# Altium project Mez.PrjPCB
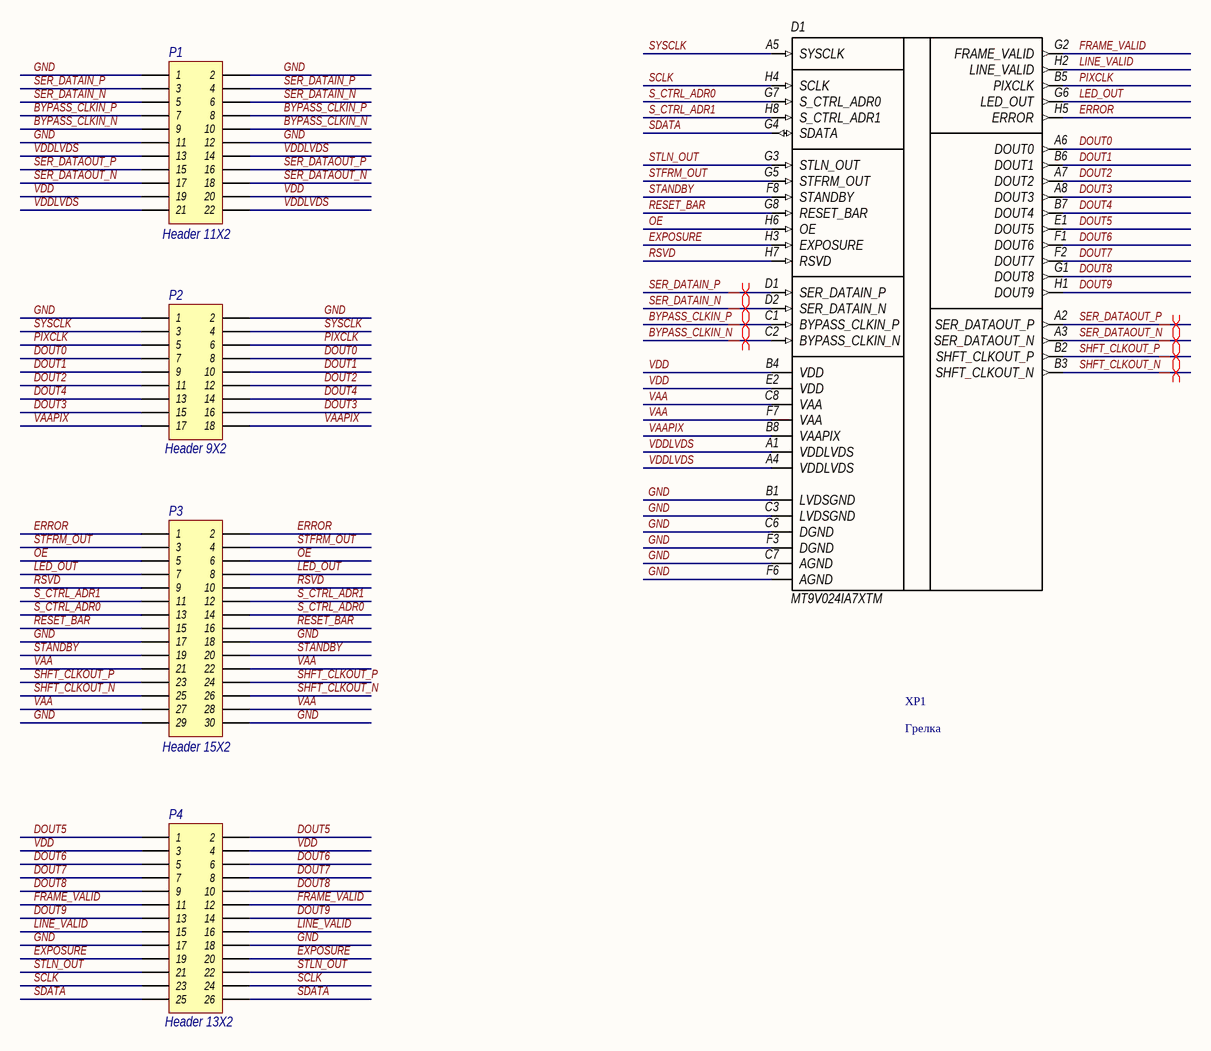
[diagram p0: MEZ_Sheet1.SchDoc]
1 sheet, 6 parts. Net scope: global (net labels, ports and power ports of the same name join across sheets).
Board file: Mez.PcbDoc

## Sheet MEZ_Sheet1.SchDoc
size A3

### Parts
D1  MT9V024IA7XTM  [MT9V024IA7XTM]
P1  Header 11X2  [HDR2X11]
P2  Header 9X2  [HDR2X9]
P3  Header 15X2  [HDR2X15]
P4  Header 13X2  [HDR2X13]
XP1  Грелка  [Грелка]

### Nets
BYPASS_CLKIN_N: D1.C2(BYPASS_CLKIN_N) P1.9 P1.10
BYPASS_CLKIN_P: D1.C1(BYPASS_CLKIN_P) P1.7 P1.8
DOUT0: D1.A6(DOUT0) P2.7 P2.8
DOUT1: D1.B6(DOUT1) P2.9 P2.10
DOUT2: D1.A7(DOUT2) P2.11 P2.12
DOUT3: D1.A8(DOUT3) P2.15 P2.16
DOUT4: D1.B7(DOUT4) P2.13 P2.14
DOUT5: D1.E1(DOUT5) P4.1 P4.2
DOUT6: D1.F1(DOUT6) P4.5 P4.6
DOUT7: D1.F2(DOUT7) P4.7 P4.8
DOUT8: D1.G1(DOUT8) P4.9 P4.10
DOUT9: D1.H1(DOUT9) P4.13 P4.14
ERROR: D1.H5(ERROR) P3.1 P3.2
EXPOSURE: D1.H3(EXPOSURE) P4.19 P4.20
FRAME_VALID: D1.G2(FRAME_VALID) P4.11 P4.12
GND: D1.B1(LVDSGND) D1.C3(LVDSGND) D1.C6(DGND) D1.C7(AGND) D1.F3(DGND) D1.F6(AGND) P1.1 P1.2 P1.11 P1.12 P2.1 P2.2 P3.17 P3.18 P3.29 P3.30 P4.17 P4.18
LED_OUT: D1.G6(LED_OUT) P3.7 P3.8
LINE_VALID: D1.H2(LINE_VALID) P4.15 P4.16
OE: D1.H6(OE) P3.5 P3.6
PIXCLK: D1.B5(PIXCLK) P2.5 P2.6
RESET_BAR: D1.G8(RESET_BAR) P3.15 P3.16
RSVD: D1.H7(RSVD) P3.9 P3.10
S_CTRL_ADR0: D1.G7(S_CTRL_ADR0) P3.13 P3.14
S_CTRL_ADR1: D1.H8(S_CTRL_ADR1) P3.11 P3.12
SCLK: D1.H4(SCLK) P4.23 P4.24
SDATA: D1.G4(SDATA) P4.25 P4.26
SER_DATAIN_N: D1.D2(SER_DATAIN_N) P1.5 P1.6
SER_DATAIN_P: D1.D1(SER_DATAIN_P) P1.3 P1.4
SER_DATAOUT_N: D1.A3(SER_DATAOUT_N) P1.17 P1.18
SER_DATAOUT_P: D1.A2(SER_DATAOUT_P) P1.15 P1.16
SHFT_CLKOUT_N: D1.B3(SHFT_CLKOUT_N) P3.25 P3.26
SHFT_CLKOUT_P: D1.B2(SHFT_CLKOUT_P) P3.23 P3.24
STANDBY: D1.F8(STANDBY) P3.19 P3.20
STFRM_OUT: D1.G5(STFRM_OUT) P3.3 P3.4
STLN_OUT: D1.G3(STLN_OUT) P4.21 P4.22
SYSCLK: D1.A5(SYSCLK) P2.3 P2.4
VAA: D1.C8(VAA) D1.F7(VAA) P3.21 P3.22 P3.27 P3.28
VAAPIX: D1.B8(VAAPIX) P2.17 P2.18
VDD: D1.B4(VDD) D1.E2(VDD) P1.19 P1.20 P4.3 P4.4
VDDLVDS: D1.A1(VDDLVDS) D1.A4(VDDLVDS) P1.13 P1.14 P1.21 P1.22

### Layout directives
differential pair: BYPASS_CLKIN_N, BYPASS_CLKIN_P, SER_DATAIN_N, SER_DATAIN_P, SER_DATAOUT_N, SER_DATAOUT_P, SHFT_CLKOUT_N, SHFT_CLKOUT_P

### Library data of the parts
D1 = MT9V024IA7XTM: КМОП матрица WVGA
P1 = Header 11X2: Header, 11-Pin, Dual row; LatestRevisionDate: 17-Jul-2002; LatestRevisionNote: Re-released for DXP Platform.; Publisher: Altium Limited
P2 = Header 9X2: Header, 9-Pin, Dual row; LatestRevisionDate: 17-Jul-2002; LatestRevisionNote: Re-released for DXP Platform.; Publisher: Altium Limited
P3 = Header 15X2: Header, 15-Pin, Dual row; LatestRevisionDate: 17-Jul-2002; LatestRevisionNote: Re-released for DXP Platform.; Publisher: Altium Limited
P4 = Header 13X2: Header, 13-Pin, Dual row; LatestRevisionDate: 17-Jul-2002; LatestRevisionNote: Re-released for DXP Platform.; Publisher: Altium Limited